# EAGLE design momolight (EAGLE 5.00)
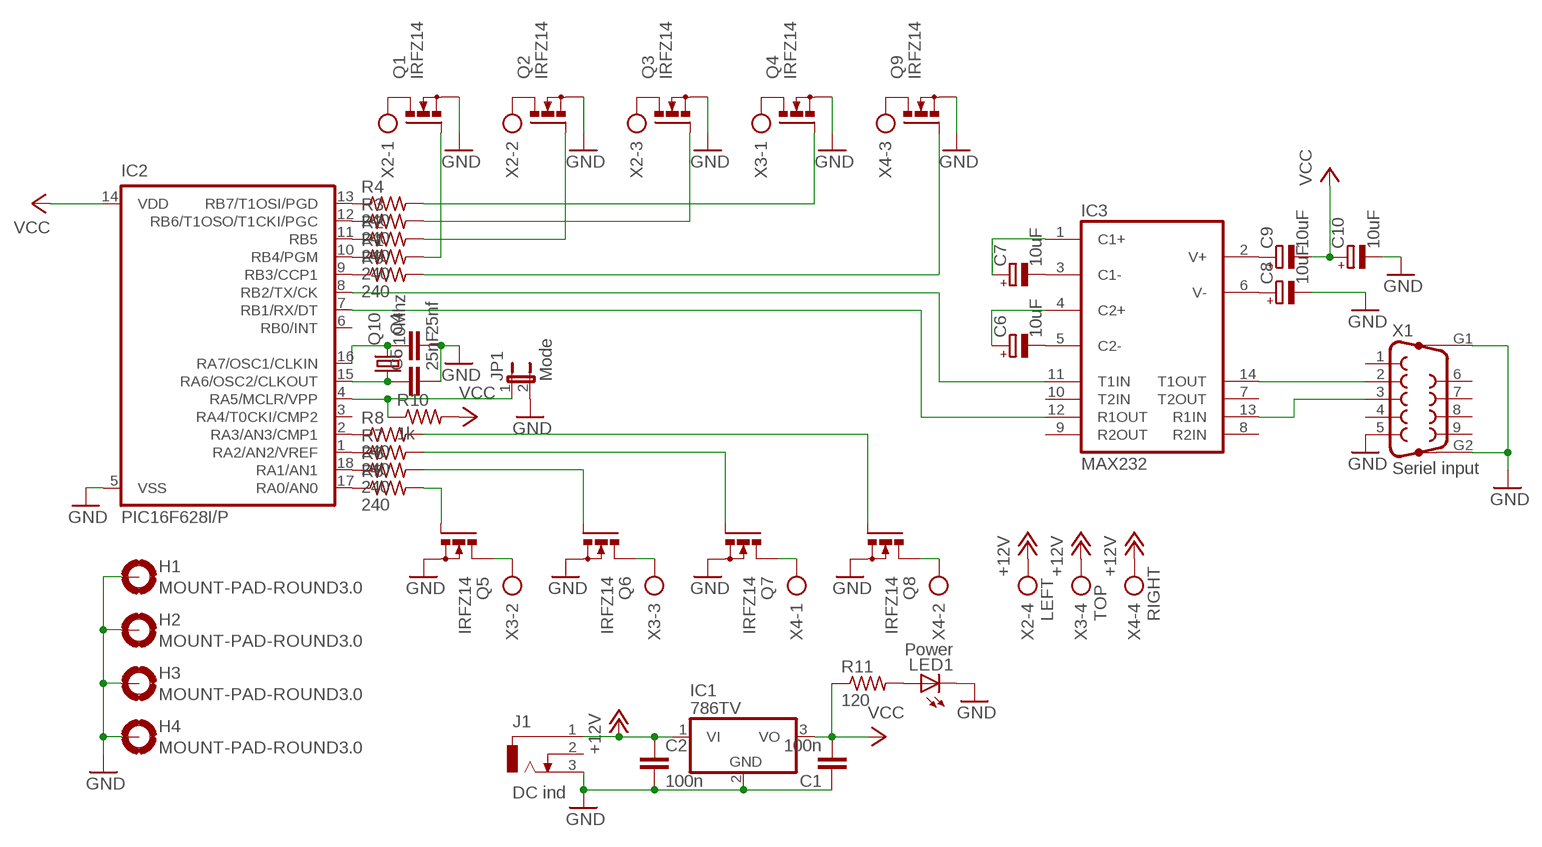
[diagram p0: schematic, sheet 1]

## Parts
C1  100n  C2.5/2  [C2.5-2]
C2  100n  C2.5/2  [C2.5-2]
C4  25nf  C-EU050-024X044  [C050-024X044]
C5  25nF  C-EU050-024X044  [C050-024X044]
C6  10uF  CPOL-EUE2.5-6  [E2,5-6]
C7  10uF  CPOL-EUE2.5-6  [E2,5-6]
C8  10uF  CPOL-EUE2.5-6  [E2,5-6]
C9  10uF  CPOL-EUE2.5-6  [E2,5-6]
C10  10uF  CPOL-EUE2.5-6  [E2,5-6]
H1  MOUNT-PAD-ROUND3.0  [3,0-PAD]
H2  MOUNT-PAD-ROUND3.0  [3,0-PAD]
H3  MOUNT-PAD-ROUND3.0  [3,0-PAD]
H4  MOUNT-PAD-ROUND3.0  [3,0-PAD]
IC1  786TV  [TO220V]
IC2  PIC16F628I/P  [DIL18]
IC3  MAX232  [DIL16]
J1  DC ind  DCJ0303  [DCJ0303]
JP1  Mode  JP1E  [JP1]
LED1  Power  LED3MM  [LED3MM]
Q1  IRFZ14  PMOSFET_NTO220BV  [TO220BV]
Q2  IRFZ14  PMOSFET_NTO220BV  [TO220BV]
Q3  IRFZ14  PMOSFET_NTO220BV  [TO220BV]
Q4  IRFZ14  PMOSFET_NTO220BV  [TO220BV]
Q5  IRFZ14  PMOSFET_NTO220BV  [TO220BV]
Q6  IRFZ14  PMOSFET_NTO220BV  [TO220BV]
Q7  IRFZ14  PMOSFET_NTO220BV  [TO220BV]
Q8  IRFZ14  PMOSFET_NTO220BV  [TO220BV]
Q9  IRFZ14  PMOSFET_NTO220BV  [TO220BV]
Q10  10Mhz  CRYSTALHC18U-V  [HC18U-V]
R1  240  R-US_0204/7  [0204/7]
R2  240  R-US_0204/7  [0204/7]
R3  240  R-US_0204/7  [0204/7]
R4  240  R-US_0204/7  [0204/7]
R5  240  R-US_0204/7  [0204/7]
R6  240  R-US_0204/7  [0204/7]
R7  240  R-US_0204/7  [0204/7]
R8  240  R-US_0204/7  [0204/7]
R9  240  R-US_0204/7  [0204/7]
R10  1k  R-US_0204/7  [0204/7]
R11  120  R-US_0204/7  [0204/7]
X1  Seriel input  F09HP  [F09HP]
X2  LEFT  AK300/4  [AK300/4]
X3  TOP  AK300/4  [AK300/4]
X4  RIGHT  AK300/4  [AK300/4]

## Nets
+12V: C2.1 IC1.1(VI) J1.1 X2.4 X3.4 X4.4
GND [GND]: C1.1 C2.2 C4.2 C5.2 C8.- C10.- H1.B3,0(MOUNT) H2.B3,0(MOUNT) H3.B3,0(MOUNT) H4.B3,0(MOUNT) IC1.2(GND) IC2.5(VSS) J1.3 JP1.2 LED1.K(C) Q1.S Q2.S Q3.S Q4.S Q5.S Q6.S Q7.S Q8.S Q9.S X1.5 X1.G1 X1.G2
N$1: IC2.10(RB4/PGM) R1.1
N$2: IC2.11(RB5) R2.1
N$3: IC2.12(RB6/T1OSO/T1CKI/PGC) R3.1
N$4: IC2.13(RB7/T1OSI/PGD) R4.1
N$5: IC2.17(RA0/AN0) R5.1
N$6: IC2.18(RA1/AN1) R6.1
N$7: IC2.1(RA2/AN2/VREF) R7.1
N$8: IC2.2(RA3/AN3/CMP1) R8.1
N$9: IC2.9(RB3/CCP1) R9.1
N$10: Q1.G R1.2
N$11: Q2.G R2.2
N$12: Q3.G R3.2
N$13: Q4.G R4.2
N$14: Q7.G R7.2
N$15: Q5.G R5.2
N$16: Q6.G R6.2
N$17: Q8.G R8.2
N$19: IC2.7(RB1/RX/DT) IC3.12(R1OUT)
N$20: IC2.8(RB2/TX/CK) IC3.11(T1IN)
N$21: IC2.4(RA5/MCLR/VPP) JP1.1 R10.1
N$22: IC3.14(T1OUT) X1.2
N$23: C4.1 IC2.16(RA7/OSC1/CLKIN) Q10.2
N$24: C5.1 IC2.15(RA6/OSC2/CLKOUT) Q10.1
N$25: IC3.13(R1IN) X1.3
N$26: C6.- IC3.5(C2-)
N$27: C7.- IC3.3(C1-)
N$28: C8.+ IC3.6(V-)
N$29: C9.+ IC3.2(V+)
N$30: C7.+ IC3.1(C1+)
N$31: C6.+ IC3.4(C2+)
N$32: Q1.D X2.1
N$33: Q2.D X2.2
N$34: Q3.D X2.3
N$35: Q4.D X3.1
N$36: Q5.D X3.2
N$37: Q6.D X3.3
N$38: Q7.D X4.1
N$39: Q8.D X4.2
N$40: Q9.D X4.3
N$41: Q9.G R9.2
N$44: LED1.A R11.2
VCC: C1.2 C9.- C10.+ IC1.3(VO) IC2.14(VDD) R10.2 R11.1
Unconnected: IC2.3(RA4/T0CKI/CMP2) IC2.6(RB0/INT) IC3.7(T2OUT) IC3.8(R2IN) IC3.9(R2OUT) IC3.10(T2IN) J1.2 X1.1 X1.4 X1.6 X1.7 X1.8 X1.9

## Power pins joined to a net without a drawn wire
GND: IC3.15(GND)
VCC: IC3.16(VCC)

## Library data of the parts
C1 C2 = capacitor-wima:C: CAPACITOR naming: grid - package width
C4 C5 = resistor:C-EU: CAPACITOR, European symbol
C6-C10 = resistor:CPOL-EU: POLARIZED CAPACITOR, European symbol
H1-H4 = holes:MOUNT-PAD-ROUND: MOUNTING PAD, round
IC1 = linear:78*: Positive VOLTAGE REGULATOR Source: http://cache.national.com/ds/LM/LM78L05.pdf http://www.fairchildsemi.com/ds/LM/LM7805.pdf
IC2 = microchip-4:PIC16F628*: MICROCONTROLLER PIC16F628(A) 16 I/O One 16-bit timer (TMR0) Two 8-bit timer (TMR0) Two comparators USART CCP/PWM Precision 4 MHz internal oscillator 2k Program Flash memory 224 bytes SRAM 128 bytes EEPROM
IC3 = maxim:MAX232: RS232 TRANSEIVER
J1 = con-jack:DCJ0303: DC POWER JACK Source: DCJ0303.pdf
JP1 = jumper:JP1E: JUMPER
LED1 = led:LED: LED OSRAM: - CHIPLED LG R971, LG N971, LY N971, LG Q971, LY Q971, LO R971, LY R971 LH N974, LH R974 LS Q976, LO Q976, LY Q976 LO Q996 - Hyper CHIPLED LW Q18S LB Q993, LB Q99A, LB R99A - SideLED LS A670, LO A670, LY A670, LG A670, LP A670 LB A673, LV A673, LT A673, LW A673 LH A674 LY A675 LS A676, LA A676, LO A676, LY A676, LW A676 LS A679, LY A679, LG A679 - Hyper Micro SIDELED® LS Y876, LA Y876, LO Y876, LY Y876 LT Y87S - SmartLED LW L88C, LW L88S LB L89C, LB L89S, LG L890 LS L89K, LO L89K, LY L89K LS L896, LA L896, LO L896, LY L896 - TOPLED LS T670, LO T670, LY T670, LG T670, LP T670 LSG T670, LSP T670, LSY T670, LOP T670, LYG T670 LG T671, LOG T671, LSG T671 LB T673, LV T673, LT T673, LW T673 LH T674 LS T676, LA T676, LO T676, LY T676, LB T676, LH T676, LSB T676, LW T676 LB T67C, LV T67C, LT T67C, LS T67K, LO T67K, LY T67K, LW E67C LS E67B, LA E67B, LO E67B, LY E67B, LB E67C, LV E67C, LT E67C LW T67C LS T679, LY T679, LG T679 LS T770, LO T770, LY T770, LG T770, LP T770 LB T773, LV T773, LT T773, LW T773 LH T774 LS E675, LA E675, LY E675, LS T675 LS T776, LA T776, LO T776, LY T776, LB T776 LHGB T686 LT T68C, LB T68C - Hyper Mini TOPLED® LB M676 - Mini TOPLED Santana® LG M470 LS M47K, LO M47K, LY M47K Source: http://www.osram.convergy.de - LUMILED® LXK2-PW12-R00, LXK2-PW12-S00, LXK2-PW14-U00, LXK2-PW14-V00 LXK2-PM12-R00, LXK2-PM12-S00, LXK2-PM14-U00 LXK2-PE12-Q00, LXK2-PE12-R00, LXK2-PE12-S00, LXK2-PE14-T00, LXK2-PE14-U00 LXK2-PB12-K00, LXK2-PB12-L00, LXK2-PB12-M00, LXK2-PB14-N00, LXK2-PB14-P00, LXK2-PB14-Q00 LXK2-PR12-L00, LXK2-PR12-M00, LXK2-PR14-Q00, LXK2-PR14-R00 LXK2-PD12-Q00, LXK2-PD12-R00, LXK2-PD12-S00 LXK2-PH12-R00, LXK2-PH12-S00 LXK2-PL12-P00, LXK2-PL12-Q00, LXK2-PL12-R00 Source: www.luxeon.com
Q1-Q9 = transistor-power:PMOSFET_N: Power MOSFET N-Channel
Q10 = crystal:CRYSTAL: CRYSTAL
R1-R11 = resistor:R-US_: RESISTOR, American symbol
X1 = con-subd:F09HP: SUB-D
X2-X4 = con-ptr500:AK300/4: CONNECTOR

## Net classes
1 +5V: width 0.61 mm
2 GND: width 0.61 mm

## Board
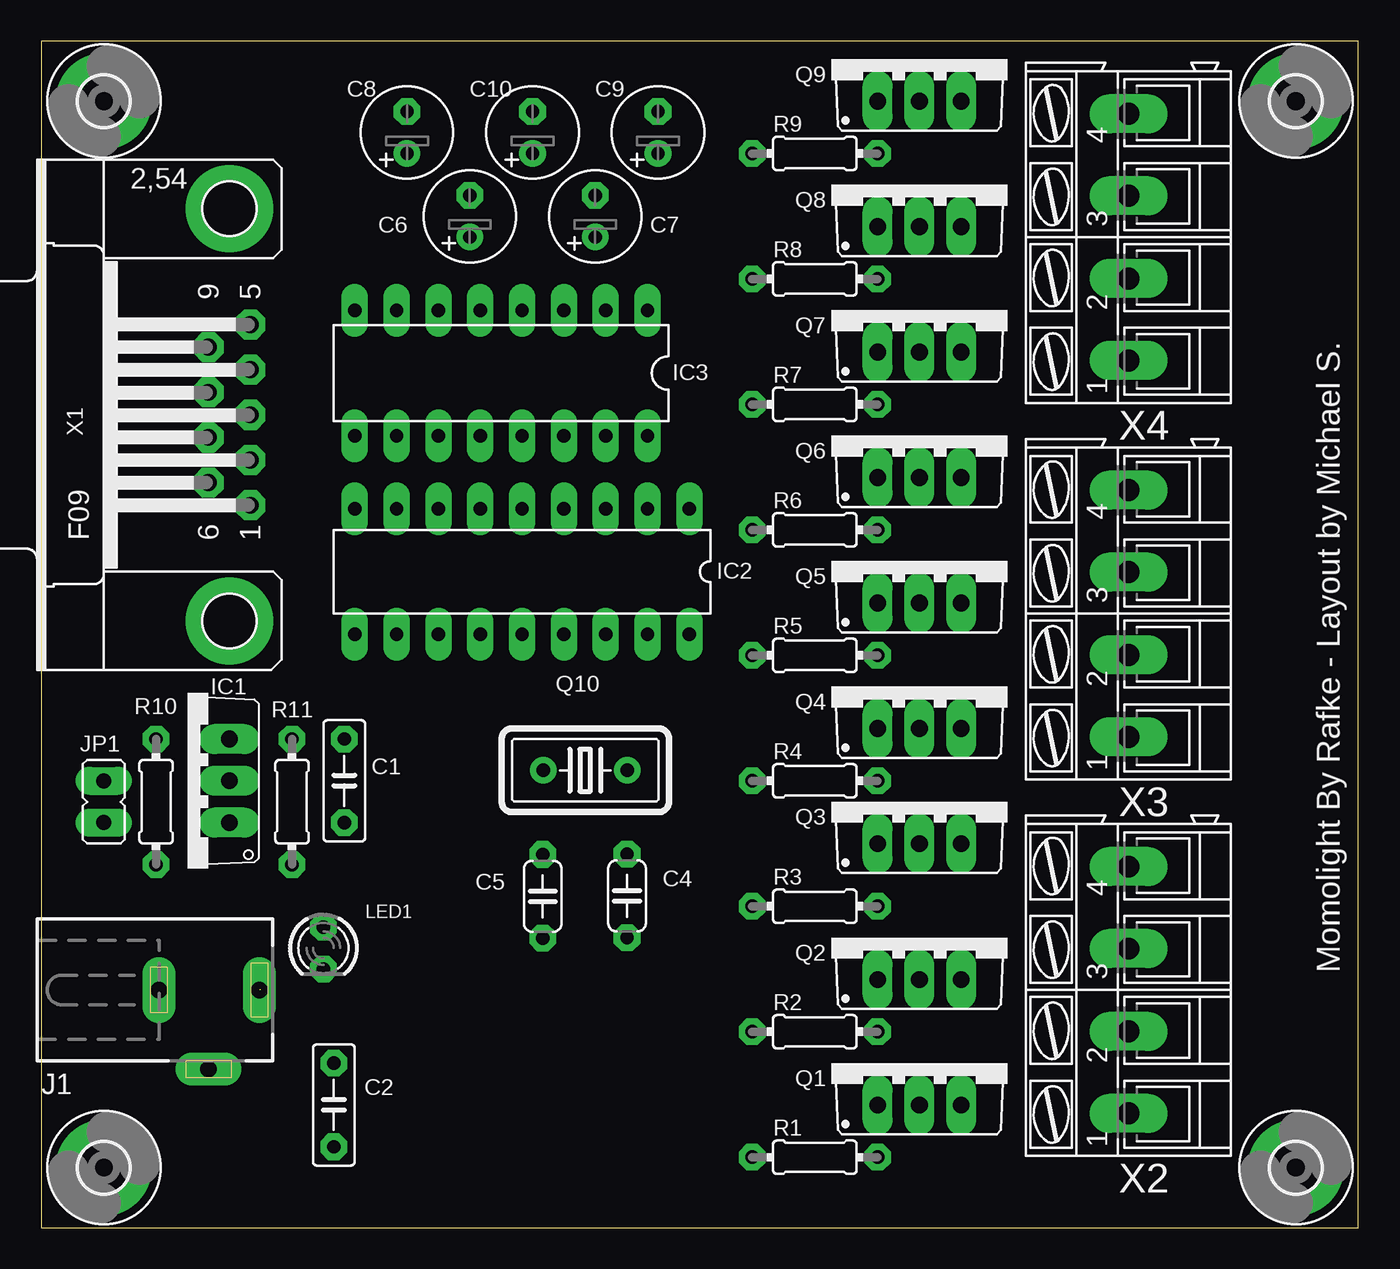
[diagram p1: board, top side]
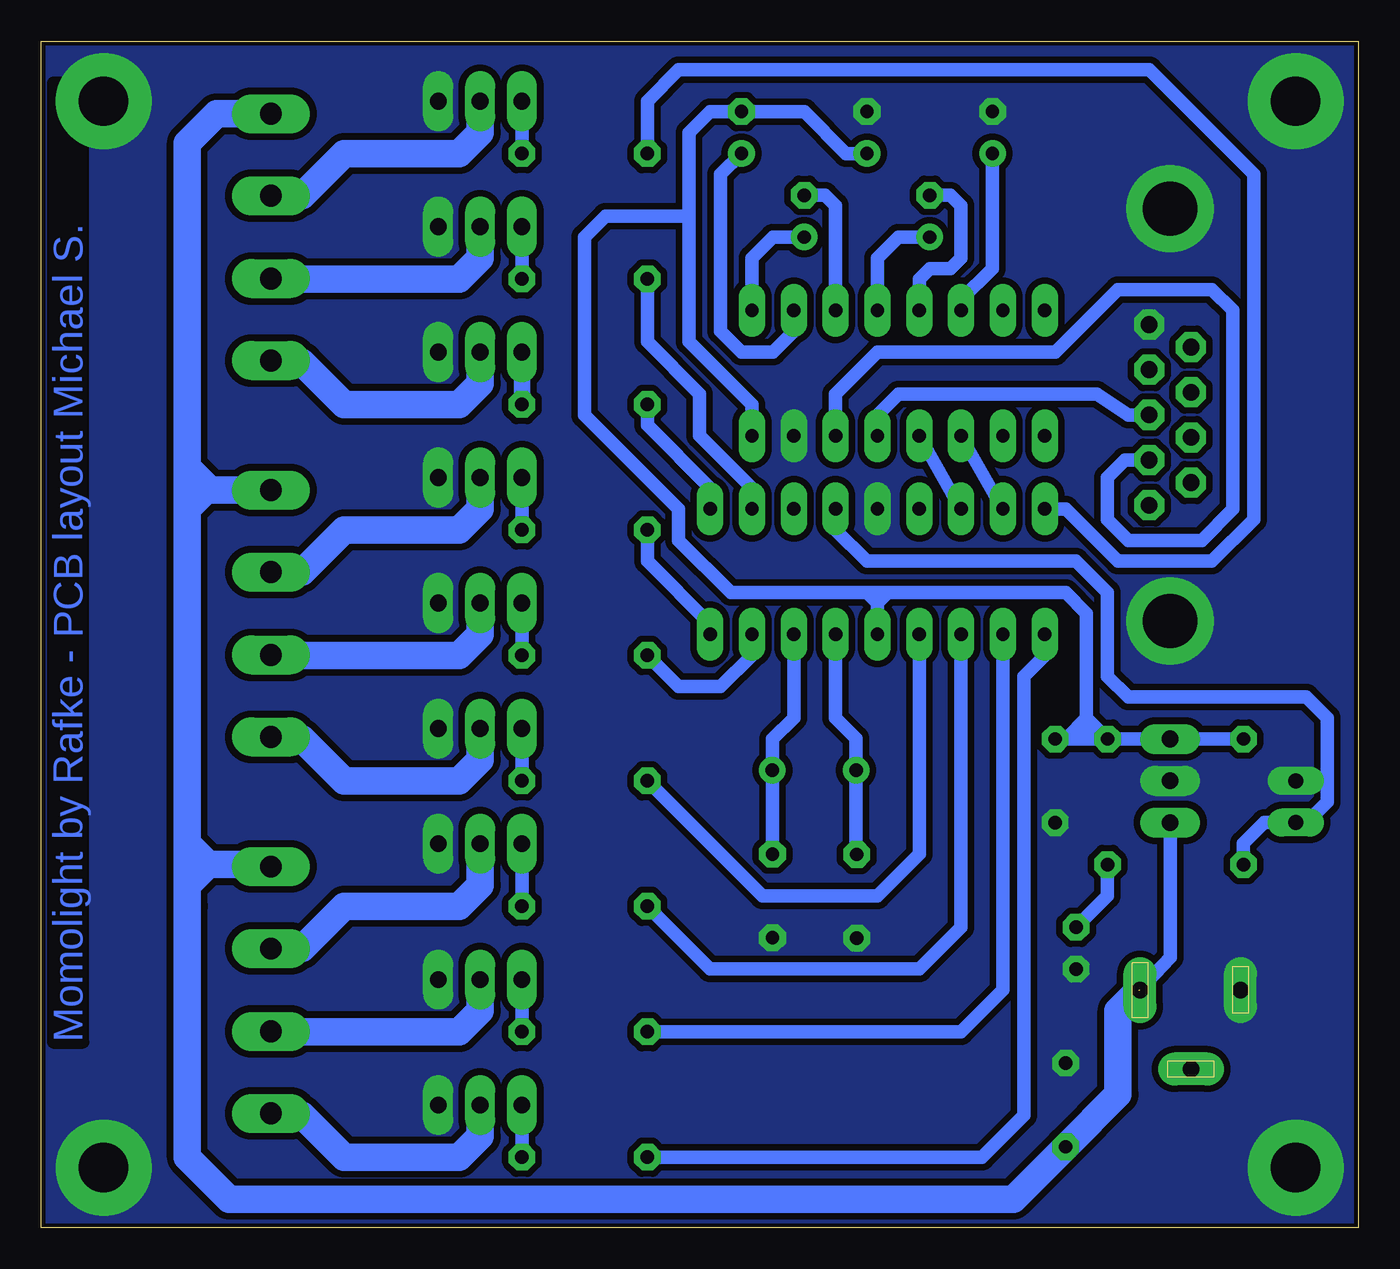
[diagram p2: board, bottom side, seen from below]

Size 79.99 x 72.06 mm. Coordinates in mm from the lower left corner, seen from the top.
Outline: 0,0 79.99,0 79.99,72.06 0,72.06 0,0
Copper layers (1*2): Top 0.035mm / dielectric 1.5mm / Route2 0.035mm
Design rules "hobby *": minimum track width 0.8mm, minimum drill 0.8mm, track to track 0.4mm, track to pad 0.4mm, pad to pad 0.4mm, via to via 0.4mm, smd to smd 8mil, copper to edge 10mil, drill to drill 4mil, minimum pad ring 0.4mm, minimum via ring 0.4mm, stop-mask expansion 0mil, vias tented up to drill 0mil, thermal gap 10mil

### Footprints (pad centres in the part's own frame; a part is rotated, then mirrored left to right if it is on the bottom)
C050-025X075 = drill 0.813 octagon: 1 -2.54,0; 2 2.54,0
C050-024X044 = drill 0.813 octagon: 1 -2.54,0; 2 2.54,0
E2,5-6 = drill 0.813 pad 1.6 round: + -1.27,0 | drill 0.813 pad 1.6 octagon: - 1.27,0
3,0-PAD = drill 3 pad 5.842 round: B3,0 0,0
TO220V = drill 1.016 long: 1 -2.54,-2.54; 2 0,-2.54; 3 2.54,-2.54
DIL18 = drill 0.813 long: 1 -10.16,-3.81; 2 -7.62,-3.81; 3 -5.08,-3.81; 4 -2.54,-3.81; 5 0,-3.81; 6 2.54,-3.81; 7 5.08,-3.81; 8 7.62,-3.81; 9 10.16,-3.81; 10 10.16,3.81; 11 7.62,3.81; 12 5.08,3.81; 13 2.54,3.81; 14 0,3.81; 15 -2.54,3.81; 16 -5.08,3.81; 17 -7.62,3.81; 18 -10.16,3.81
DIL16 = drill 0.813 long: 1 -8.89,-3.81; 2 -6.35,-3.81; 3 -3.81,-3.81; 4 -1.27,-3.81; 5 1.27,-3.81; 6 3.81,-3.81; 7 6.35,-3.81; 8 8.89,-3.81; 9 8.89,3.81; 10 6.35,3.81; 11 3.81,3.81; 12 1.27,3.81; 13 -1.27,3.81; 14 -3.81,3.81; 15 -6.35,3.81; 16 -8.89,3.81
DCJ0303 = drill 1 pad 2 long: 1 0,3.1; 2 4.8,0; 3 0,-3
JP1 = drill 0.914 long: 1 0,-1.27; 2 0,1.27
LED3MM = drill 0.813 octagon: A -1.27,0; K 1.27,0
TO220BV = drill 1.016 long: D 0,-2.54; G -2.54,-2.54; S 2.54,-2.54
HC18U-V = drill 0.813 round: 1 -2.54,0; 2 2.54,0
0204/7 = drill 0.813 octagon: 1 -3.81,0; 2 3.81,0
F09HP = drill 1.016 octagon: 1 -5.486,-1.27; 2 -2.743,-1.27; 3 0,-1.27; 4 2.743,-1.27; 5 5.486,-1.27; 6 -4.115,1.27; 7 -1.372,1.27; 8 1.372,1.27; 9 4.115,1.27 | drill 3.302 pad 5.08 round: G1 -12.522,0; G2 12.522,0
AK300/4 = drill 1.321 long: 1 -7.493,0; 2 -2.515,0; 3 2.515,0; 4 7.493,0

### Placement (x,y rotation side)
C1  100n  [C050-025X075]  18.41,27.14 90 top
C2  100n  [C050-025X075]  17.77,7.46 90 top
C4  35.58,20.15 270 top
C5  30.46,20.13 270 top
C6  26.03,61.43 90 top
C7  33.65,61.43 90 top
C8  22.22,66.51 90 top
C9  37.46,66.51 90 top
C10  29.84,66.51 90 top
H1  3.8,3.65 0 top
H2  3.8,68.41 0 top
H3  76.2,68.41 0 top
H4  76.2,3.65 0 top
IC1  8.88,27.14 90 top
IC2  29.2,39.84 180 top
IC3  27.93,51.91 180 top
J1  10.16,14.44 270 top
JP1  3.8,25.87 0 top
LED1  17.14,16.98 270 top
Q1  53.34,10 0 top
Q2  53.34,17.62 0 top
Q3  53.34,25.87 0 top
Q4  53.34,32.86 0 top
Q5  53.34,40.48 0 top
Q6  53.34,48.1 0 top
Q7  53.34,55.72 0 top
Q8  53.34,63.34 0 top
Q9  53.34,70.95 0 top
Q10  33.04,27.78 0 top
R1  46.98,4.28 0 top
R2  46.98,11.9 0 top
R3  46.98,19.52 0 top
R4  46.98,27.14 0 top
R5  46.98,34.76 0 top
R6  46.98,42.38 0 top
R7  46.98,50 0 top
R8  46.98,57.62 0 top
R9  46.98,65.24 0 top
R10  6.98,25.87 90 top
R11  15.24,25.87 270 top
X1  11.43,49.37 90 top
X2  66.04,14.44 90 top
X3  66.04,37.3 90 top
X4  66.04,60.16 90 top

### Tracks (layer width: path | path; a pad name or v marks a point on that pad's centre or on a via)
+12V  (1 unrouted)
  Bottom 0.813: J1.1 11.43,16.41 IC1.1
  Bottom 1.676: X2.4 67.31,22.06 69.84,22.06 | 71.12,22.06 69.84,22.06 | 71.12,44.79 X3.4 | 71.12,22.06 71.12,23.33 | 71.12,23.33 71.12,43.65 | 71.12,43.65 71.12,44.79 | 71.12,19.52 71.12,4.28 68.58,1.74 20.95,1.74 C2.1 14.6,8.09 14.6,13.17 13.33,14.44 | 71.12,19.52 71.12,22.06 | X4.4 69.34,67.65 71.12,65.88 71.12,46.19 | 71.12,44.79 71.12,46.19 | 71.12,23.33 69.84,22.06 | 71.12,19.52 71.12,23.33 | 71.12,19.52 71.12,20.79 69.84,22.06 | 71.12,46.19 69.84,44.92 71.12,43.65 | 71.12,43.65 71.12,46.19
GND
  pour Bottom (no thermals): -0.01,72.22 80.01,72.22 80.01,-0.16 -0.01,-0.16
N$1
  Bottom 0.813: IC2.10 19.04,34.76 20.31,33.49 20.31,6.82 22.85,4.28 R1.1
N$2
  Bottom 0.813: IC2.11 21.58,14.44 24.12,11.9 R2.1
N$3
  Bottom 0.813: IC2.12 24.12,18.25 26.66,15.71 39.37,15.71 R3.1
N$4
  Bottom 0.813: IC2.13 26.66,22.7 29.2,20.16 36.19,20.16 R4.1
N$5
  Bottom 0.813: IC2.17 36.82,34.76 38.73,32.86 41.27,32.86 R5.1
N$6
  Bottom 0.813: IC2.18 39.37,36.66 43.17,40.48 R6.1
N$7
  Bottom 0.813: IC2.1 39.37,44.92 43.17,48.73 R7.1
N$8
  Bottom 0.813: IC2.2 36.82,44.92 40,48.1 40,50.64 43.17,53.81 R8.1
N$9
  Bottom 0.813: IC2.9 17.77,43.65 14.6,40.48 8.88,40.48 6.35,43.02 6.35,63.97 12.7,70.32 41.27,70.32 43.17,68.41 R9.1
N$10
  Bottom 0.813: R1.2 Q1.G
N$11
  Bottom 0.813: R2.2 Q2.G
N$12
  Bottom 0.813: R3.2 Q3.G
N$13
  Bottom 0.813: R4.2 Q4.G
N$14
  Bottom 1.016: R7.2 Q7.G
N$15
  Bottom 0.813: R5.2 Q5.G
N$16
  Bottom 0.813: R6.2 Q6.G
N$17
  Bottom 0.813: R8.2 Q8.G
N$19
  Bottom 0.8: IC2.7 IC3.12
N$20
  Bottom 0.8: IC2.8 IC3.11
N$21
  Bottom 0.813: IC2.4 31.74,42.38 29.84,40.48 17.14,40.48 15.24,38.57 15.24,33.49 13.96,32.22 3.17,32.22 1.9,30.95 1.9,25.87 3.17,24.6 JP1.1 5.71,24.6 6.98,23.33 R10.1
N$22
  Bottom 0.813: X1.2 14.17,46.62 15.24,45.55 15.24,43.02 13.96,41.74 9.52,41.74 7.62,43.65 7.62,55.72 8.88,56.98 14.6,56.98 18.41,53.18 29.2,53.18 31.74,50.64 IC3.14
N$23
  Bottom 0.813: IC2.16 34.28,30.95 35.58,29.68 Q10.2 35.58,22.72 35.55,22.7 35.56,22.69 C4.1
N$24
  Bottom 0.813: IC2.15 31.74,30.95 30.5,29.71 Q10.1 30.5,22.72 30.46,22.68 C5.1
N$25
  Bottom 0.813: X1.3 13.96,49.37 15.87,50.64 27.93,50.64 29.2,49.37 IC3.13
N$26
  Bottom 0.813: C6.- 24.76,62.7 24.12,62.07 24.12,58.89 24.76,58.26 26.03,58.26 26.66,57.62 IC3.5
N$27
  Bottom 0.813: C7.- 32.38,62.7 31.74,62.07 IC3.3
N$28
  Bottom 0.813: C8.+ 22.22,58.26 24.12,56.35 IC3.6
N$29
  Bottom 0.813: IC3.2 34.28,54.45 35.55,53.18 37.46,53.18 38.73,54.45 38.73,63.97 C9.+
N$30
  Bottom 0.813: C7.+ 35.55,60.16 36.82,58.89 IC3.1
N$31
  Bottom 0.813: C6.+ 27.93,60.16 29.2,58.89 IC3.4
N$32
  Bottom 1.676: Q1.D 53.34,5.55 54.6,4.28 61.59,4.28 64.13,6.82 66.04,6.82 X2.1
N$33
  Bottom 1.676: Q2.D 53.34,13.17 54.6,11.9 64.77,11.9 X2.2
N$34
  Bottom 1.676: X2.3 64.16,16.96 61.59,19.52 54.6,19.52 53.34,20.79 Q3.D
N$35
  Bottom 1.676: Q4.D 53.34,28.41 54.6,27.14 61.59,27.14 64.13,29.68 66.04,29.68 X3.1
N$36
  Bottom 1.676: Q5.D 53.34,36.03 54.6,34.76 64.77,34.76 X3.2
N$37
  Bottom 1.676: X3.3 64.16,39.81 61.59,42.38 54.6,42.38 53.34,43.65 Q6.D
N$38
  Bottom 1.676: Q7.D 53.34,51.27 54.6,50 61.59,50 64.13,52.54 X4.1
N$39
  Bottom 1.676: Q8.D 53.34,58.89 54.6,57.62 65.4,57.62 X4.2
N$40
  Bottom 1.676: X4.3 64.16,62.68 61.59,65.24 54.6,65.24 53.34,66.51 Q9.D
N$41
  Bottom 0.813: R9.2 Q9.G
N$44
  Bottom 0.813: R11.2 15.24,20.16 LED1.A
VCC
  Bottom 0.813: R10.2 IC1.3 | IC1.3 R11.1 | R11.1 16.5,29.68 | 16.5,29.68 17.77,29.68 | 28.57,38.57 29.2,38.57 | 29.2,38.57 29.2,37.94 | 29.2,37.94 IC2.14 | 29.2,38.57 29.84,38.57 | IC1.3 R11.1 | 28.57,38.57 29.2,37.94 | 28.57,38.57 29.84,38.57 | 29.2,37.94 29.84,38.57 | 28.57,38.57 17.77,38.57 16.5,37.3 16.5,30.95 | 16.5,29.68 16.5,30.95 | IC3.16 36.82,50 40.63,53.81 40.63,61.43 | R11.1 16.5,30.95 | R11.1 17.77,29.68 | 17.77,29.68 C1.2 | 16.5,30.95 17.77,29.68 | 29.84,38.57 38.09,38.57 41.27,41.74 41.27,43.65 46.98,49.37 46.98,60.16 45.71,61.43 40.63,61.43 | C10.+ 31.11,65.24 33.65,67.78 C9.- 39.37,67.78 40.63,66.51 40.63,61.43

### Text on the board
Bottom: Momolight by Rafke - PCB layout Michael S.
tNames: Momolight By Rafke - Layout by Michael S.